# EAGLE design Schaltplan_neu (EAGLE 9.6.2)
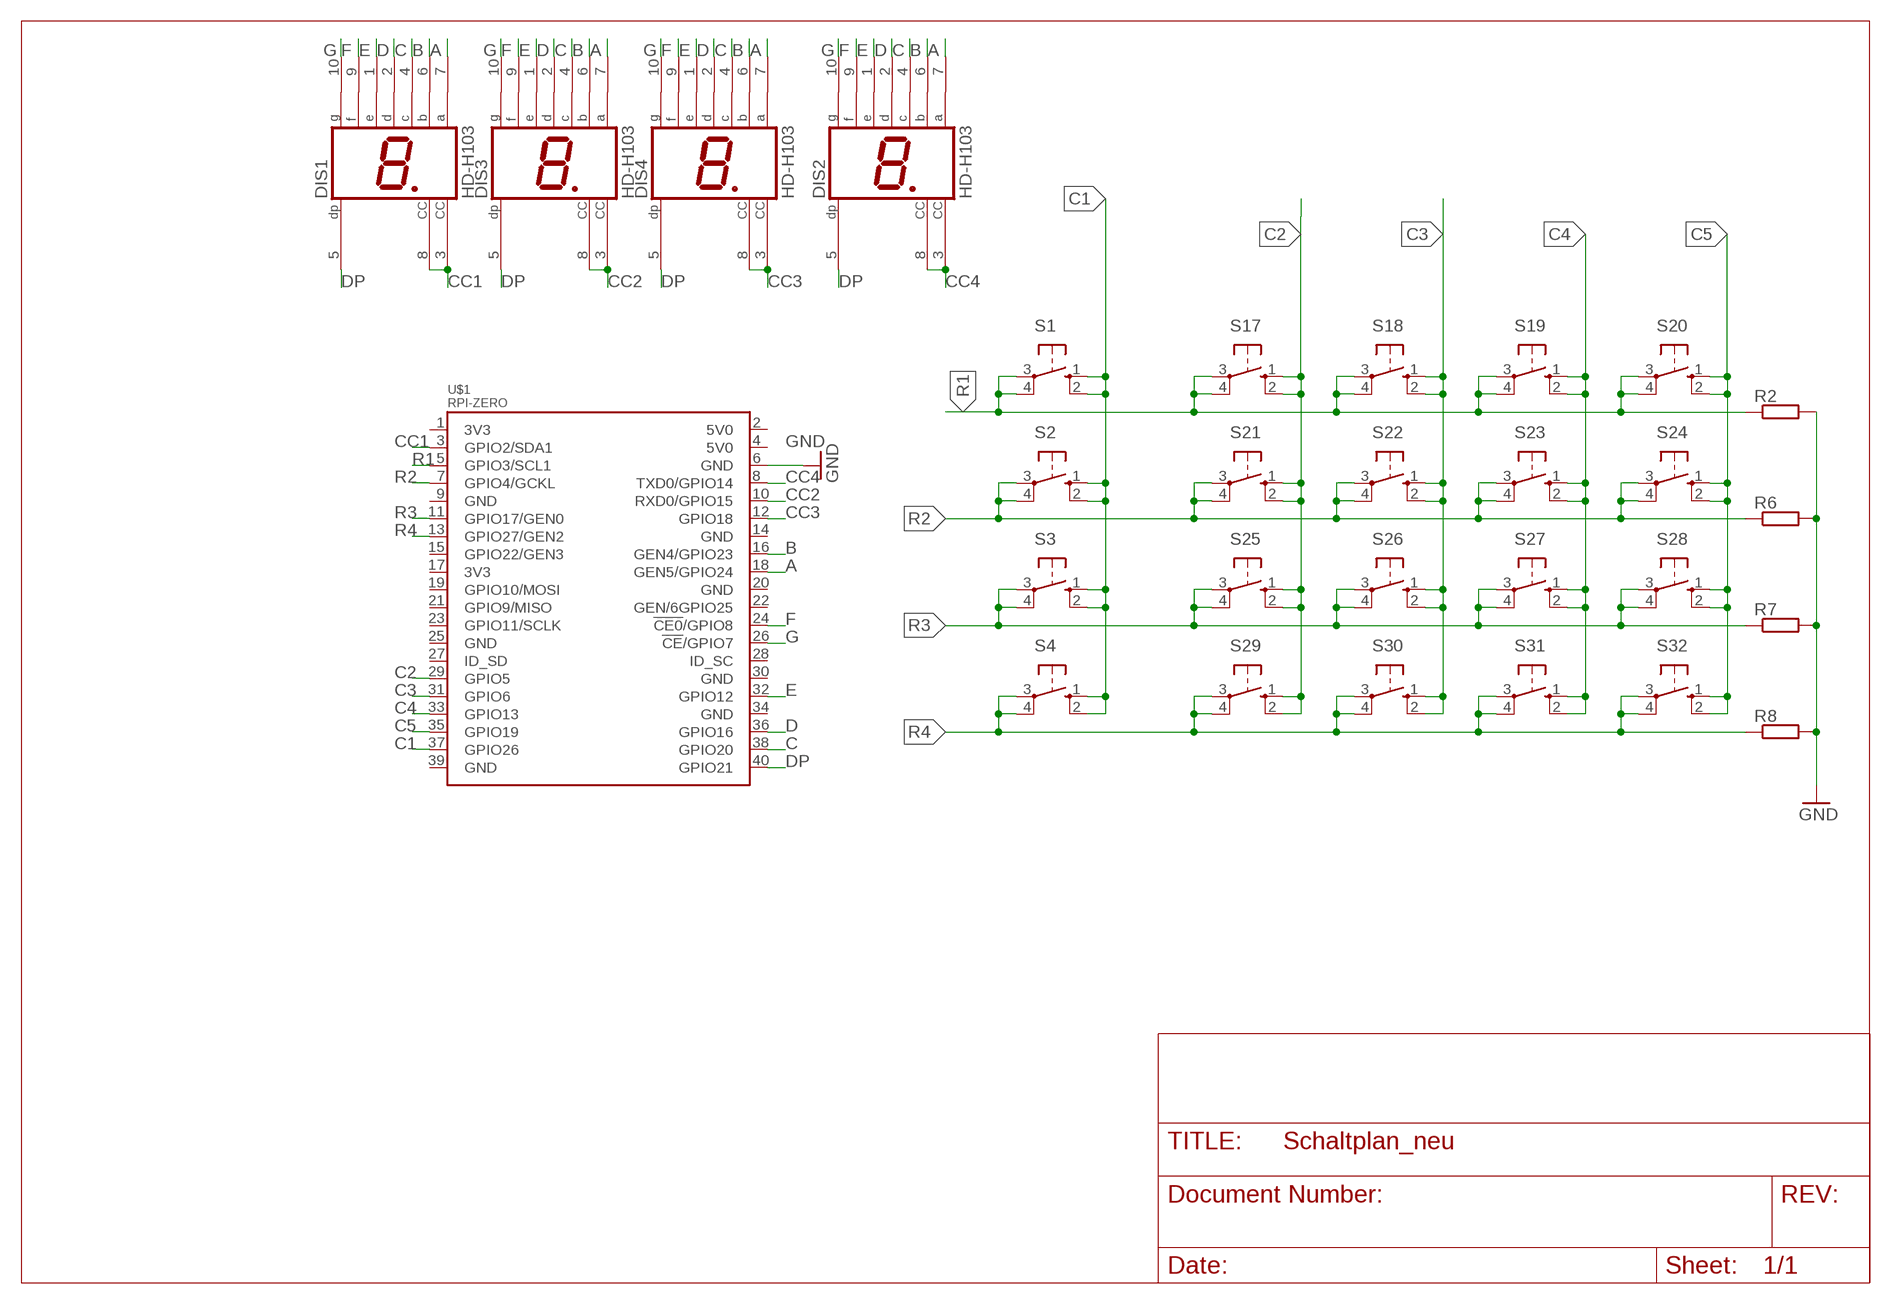
[diagram p0: schematic, sheet 1]

## Parts
DIS1  HD-H103  [HDSP-M]
DIS2  HD-H103  [HDSP-M]
DIS3  HD-H103  [HDSP-M]
DIS4  HD-H103  [HDSP-M]
R2  R-EU_0207/10  [0207/10]
R6  R-EU_0207/10  [0207/10]
R7  R-EU_0207/10  [0207/10]
R8  R-EU_0207/10  [0207/10]
S1  10-XX  [B3F-10XX]
S2  10-XX  [B3F-10XX]
S3  10-XX  [B3F-10XX]
S4  10-XX  [B3F-10XX]
S17  10-XX  [B3F-10XX]
S18  10-XX  [B3F-10XX]
S19  10-XX  [B3F-10XX]
S20  10-XX  [B3F-10XX]
S21  10-XX  [B3F-10XX]
S22  10-XX  [B3F-10XX]
S23  10-XX  [B3F-10XX]
S24  10-XX  [B3F-10XX]
S25  10-XX  [B3F-10XX]
S26  10-XX  [B3F-10XX]
S27  10-XX  [B3F-10XX]
S28  10-XX  [B3F-10XX]
S29  10-XX  [B3F-10XX]
S30  10-XX  [B3F-10XX]
S31  10-XX  [B3F-10XX]
S32  10-XX  [B3F-10XX]
U$1  RPI-ZERO  [RASP_PI_ZERO_BOARD_FULL]

## Nets
A: DIS1.7(A) DIS2.7(A) DIS3.7(A) DIS4.7(A) U$1.18(GEN5/GPIO24)
B: DIS1.6(B) DIS2.6(B) DIS3.6(B) DIS4.6(B) U$1.16(GEN4/GPIO23)
C: DIS1.4(C) DIS2.4(C) DIS3.4(C) DIS4.4(C) U$1.38(GPIO20)
C1: S1.1(S) S1.2(S1) S2.1(S) S2.2(S1) S3.1(S) S3.2(S1) S4.1(S) S4.2(S1) U$1.37(GPIO26)
C2: S17.1(S) S17.2(S1) S21.1(S) S21.2(S1) S25.1(S) S25.2(S1) S29.1(S) S29.2(S1) U$1.29(GPIO5)
C3: S18.1(S) S18.2(S1) S22.1(S) S22.2(S1) S26.1(S) S26.2(S1) S30.1(S) S30.2(S1) U$1.31(GPIO6)
C4: S19.1(S) S19.2(S1) S23.1(S) S23.2(S1) S27.1(S) S27.2(S1) S31.1(S) S31.2(S1) U$1.33(GPIO13)
C5: S20.1(S) S20.2(S1) S24.1(S) S24.2(S1) S28.1(S) S28.2(S1) S32.1(S) S32.2(S1) U$1.35(GPIO19)
CC1: DIS1.3(CC) DIS1.8(CC) U$1.3(GPIO2/SDA1)
CC2: DIS3.3(CC) DIS3.8(CC) U$1.10(RXD0/GPIO15)
CC3: DIS4.3(CC) DIS4.8(CC) U$1.12(GPIO18)
CC4: DIS2.3(CC) DIS2.8(CC) U$1.8(TXD0/GPIO14)
D: DIS1.2(D) DIS2.2(D) DIS3.2(D) DIS4.2(D) U$1.36(GPIO16)
DP: DIS1.5(DP) DIS2.5(DP) DIS3.5(DP) DIS4.5(DP) U$1.40(GPIO21)
E: DIS1.1(E) DIS2.1(E) DIS3.1(E) DIS4.1(E) U$1.32(GPIO12)
F: DIS1.9(F) DIS2.9(F) DIS3.9(F) DIS4.9(F) U$1.24(!CE0!/GPIO8)
G: DIS1.10(G) DIS2.10(G) DIS3.10(G) DIS4.10(G) U$1.26(!CE!/GPIO7)
GND: R2.2 R6.2 R7.2 R8.2 U$1.6(GND)
R1: R2.1 S1.3(P) S1.4(P1) S17.3(P) S17.4(P1) S18.3(P) S18.4(P1) S19.3(P) S19.4(P1) S20.3(P) S20.4(P1) U$1.5(GPIO3/SCL1)
R2: R6.1 S2.3(P) S2.4(P1) S21.3(P) S21.4(P1) S22.3(P) S22.4(P1) S23.3(P) S23.4(P1) S24.3(P) S24.4(P1) U$1.7(GPIO4/GCKL)
R3: R7.1 S3.3(P) S3.4(P1) S25.3(P) S25.4(P1) S26.3(P) S26.4(P1) S27.3(P) S27.4(P1) S28.3(P) S28.4(P1) U$1.11(GPIO17/GEN0)
R4: R8.1 S4.3(P) S4.4(P1) S29.3(P) S29.4(P1) S30.3(P) S30.4(P1) S31.3(P) S31.4(P1) S32.3(P) S32.4(P1) U$1.13(GPIO27/GEN2)
Unconnected: U$1.1(3V3) U$1.2(5V0) U$1.4(5V0) U$1.9(GND) U$1.14(GND) U$1.15(GPIO22/GEN3) U$1.17(3V3) U$1.19(GPIO10/MOSI) U$1.20(GND) U$1.21(GPIO9/MISO) U$1.22(GEN/6GPIO25) U$1.23(GPIO11/SCLK) U$1.25(GND) U$1.27(ID_SD) U$1.28(ID_SC) U$1.30(GND) U$1.34(GND) U$1.39(GND)

## Library data of the parts
DIS1-DIS4 = display-hp:HD-H103: LED DISPLAY 1-character 7 segment, decimal point right; OC_FARNELL: unknown; OC_NEWARK: unknown
R2 R6-R8 = rcl:R-EU_: RESISTOR, European symbol; SPICEPREFIX: R
S1-S4 S17-S32 = switch-omron:10-XX: OMRON SWITCH; MPN: B3F-1000; OC_FARNELL: 176432; OC_NEWARK: 36M3542
U$1 = rpi-zero_2:RPI-ZERO

## Board
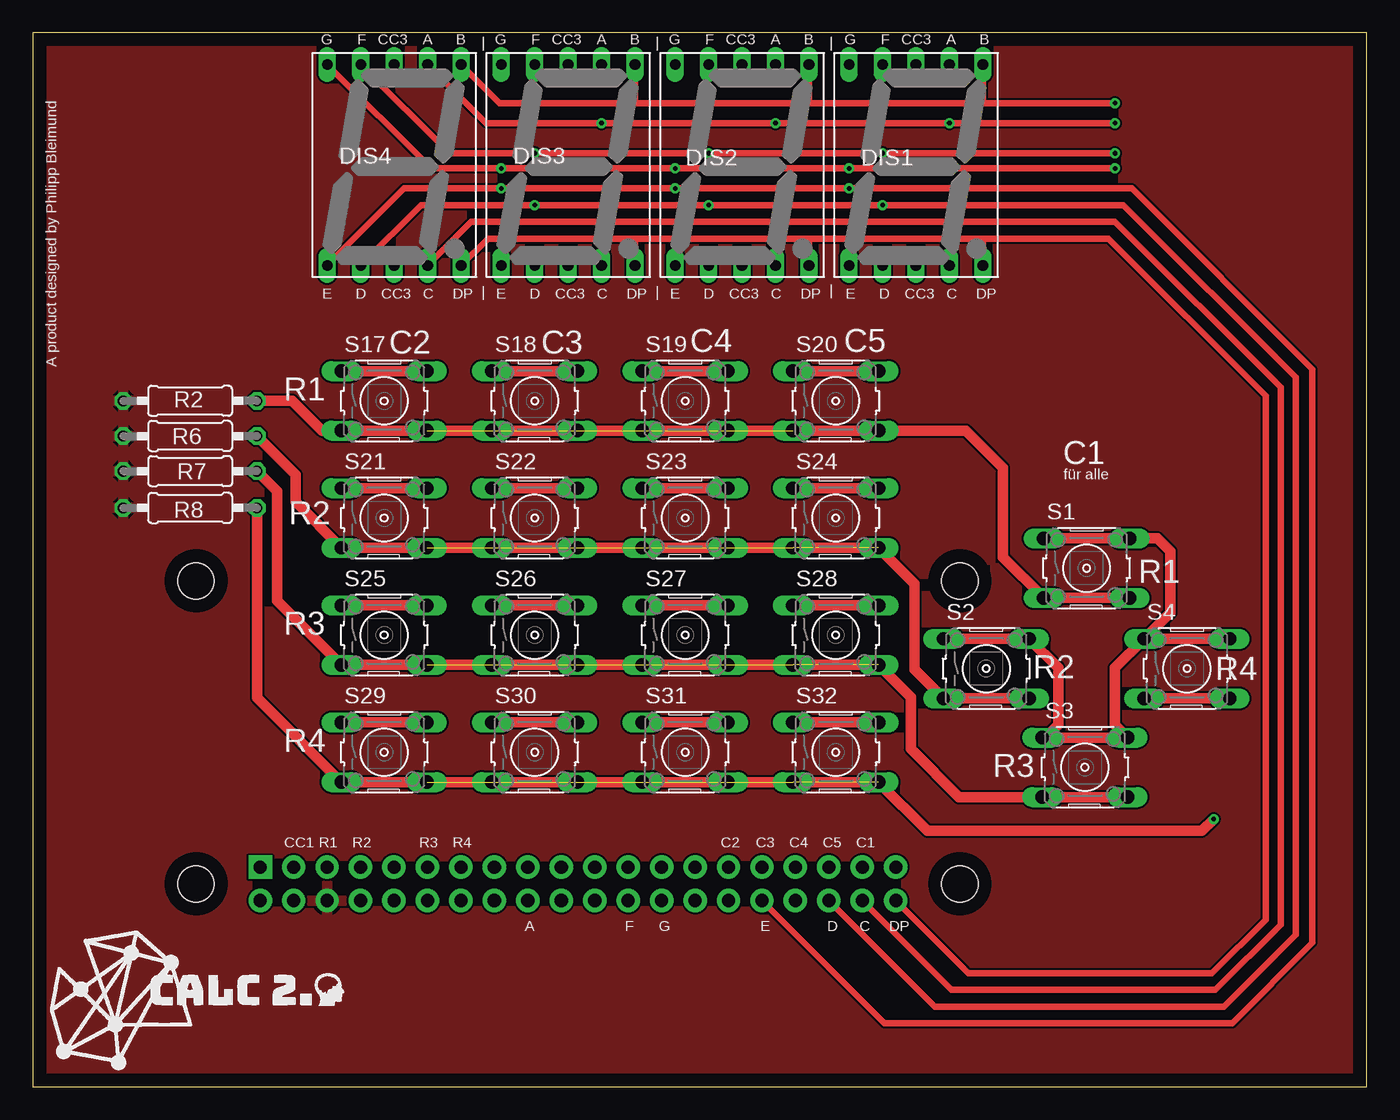
[diagram p1: board, top side]
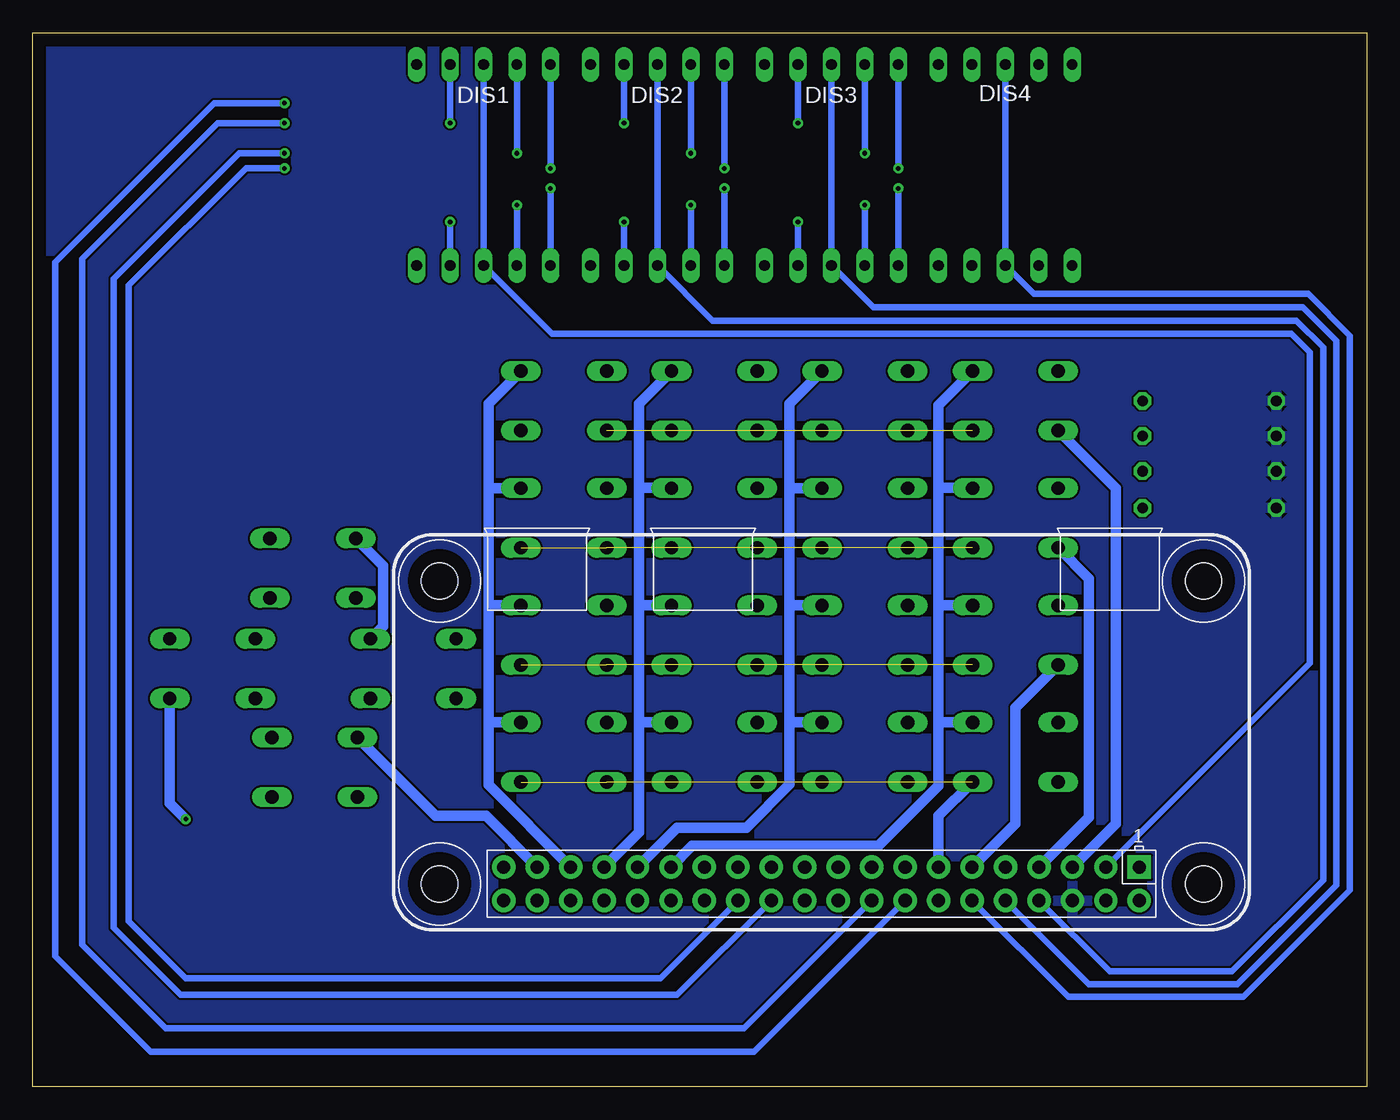
[diagram p2: board, bottom side, seen from below]

Size 101.27 x 80 mm. Coordinates in mm from the lower left corner, seen from the top.
Outline: 0,0 101.27,0 101.27,80 0,80 0,0
Copper layers (1*16): Top 0.035mm / dielectric 1.5mm / Bottom 0.035mm
Design rules "default": minimum track width 6mil, minimum drill 0.35mm, track to track 6mil, track to pad 6mil, pad to pad 6mil, via to via 6mil, smd to smd 6mil, copper to edge 40mil, drill to drill 6mil, minimum pad ring 10mil, minimum via ring 8mil, stop-mask expansion 4mil, vias tented up to drill 0mil, thermal gap 10mil

### Footprints (pad centres in the part's own frame; a part is rotated, then mirrored left to right if it is on the bottom)
HDSP-M = drill 0.813 long: 1 -5.08,-7.62; 2 -2.54,-7.62; 3 0,-7.62; 4 2.54,-7.62; 5 5.08,-7.62; 6 5.08,7.62; 7 2.54,7.62; 8 0,7.62; 9 -2.54,7.62; 10 -5.08,7.62
0207/10 = drill 0.813 octagon: 1 -5.08,0; 2 5.08,0
B3F-10XX = drill 1.016 long: 1 -3.251,2.261; 2 3.251,2.261; 3 -3.251,-2.261; 4 3.251,-2.261
RASP_PI_ZERO_BOARD_FULL = drill 1 pad 1.778 square: 1 8.37,25.23 | drill 1 pad 1.778: 2 8.37,27.77; 3 10.91,25.23; 4 10.91,27.77; 5 13.45,25.23; 6 13.45,27.77; 7 15.99,25.23; 8 15.99,27.77; 9 18.53,25.23; 10 18.53,27.77; 11 21.07,25.23; 12 21.07,27.77; 13 23.61,25.23; 14 23.61,27.77; 15 26.15,25.23; 16 26.15,27.77; 17 28.69,25.23; 18 28.69,27.77; 19 31.23,25.23; 20 31.23,27.77; 21 33.77,25.23; 22 33.77,27.77; 23 36.31,25.23; 24 36.31,27.77; 25 38.85,25.23; 26 38.85,27.77; 27 41.39,25.23; 28 41.39,27.77; 29 43.93,25.23; 30 43.93,27.77; 31 46.47,25.23; 32 46.47,27.77; 33 49.01,25.23; 34 49.01,27.77; 35 51.55,25.23; 36 51.55,27.77; 37 54.09,25.23; 38 54.09,27.77; 39 56.63,25.23; 40 56.63,27.77 | hole 2.75: 3.5,3.5; 3.5,26.5; 61.5,3.5; 61.5,26.5

### Placement (x,y rotation side)
DIS1  67.06,69.98 0 top
DIS2  53.85,69.98 0 top
DIS3  40.64,69.98 0 top
DIS4  27.43,69.98 0 top
R2  11.94,52.07 180 top
R6  11.94,49.4 180 top
R7  11.94,46.74 180 top
R8  11.94,43.94 180 top
S1  80.01,39.37 0 top
S2  72.39,31.75 0 top
S3  79.88,24.26 0 top
S4  87.63,31.75 0 top
S17  26.67,52.07 0 top
S18  38.1,52.07 0 top
S19  49.53,52.07 0 top
S20  60.96,52.07 0 top
S21  26.67,43.18 0 top
S22  38.1,43.18 0 top
S23  49.53,43.18 0 top
S24  60.96,43.18 0 top
S25  26.67,34.29 0 top
S26  38.1,34.29 0 top
S27  49.53,34.29 0 top
S28  60.96,34.29 0 top
S29  26.67,25.4 0 top
S30  38.1,25.4 0 top
S31  49.53,25.4 0 top
S32  60.96,25.4 0 top
U$1  8.89,41.91 180 bottom

### Tracks (layer width: path | path; a pad name or v marks a point on that pad's centre or on a via)
A  (via drill 0.35)
  Top 0.508: v82.17,73.15 v69.6,73.15 v56.39,73.15 v43.18,73.15 34.42,73.15 DIS4.7
  Bottom 0.508: U$1.18 47.28,4.45 91.19,4.45 97.54,10.79 97.54,62.87 87.25,73.15 v82.17,73.15 | DIS3.7 v43.18,73.15 | DIS2.7 v56.39,73.15 | DIS1.7 v69.6,73.15
B  (via drill 0.35)
  Top 0.508: DIS4.6 35.43,74.68 45.72,74.68 | v82.17,74.68 72.14,74.68 | 72.14,74.68 58.93,74.68 | 58.93,74.68 45.72,74.68 | DIS3.6 45.72,74.68 | DIS2.6 58.93,74.68 | DIS1.6 72.14,74.68
  Bottom 0.508: U$1.16 46.51,2.67 92.33,2.67 99.57,9.91 99.57,62.61 87.5,74.68 v82.17,74.68
C  (via drill 0.35)
  Top 0.508: U$1.38 69.75,7.37 89.79,7.37 94.74,12.32 94.74,53.09 82.17,65.66 v69.6,65.66 v56.39,65.66 v43.18,65.66 33.27,65.66 DIS4.4
  Bottom 0.508: DIS3.4 v43.18,65.66 | DIS2.4 v56.39,65.66 | DIS1.4 v69.6,65.66
C1
  Top 0.813: S4.1 S4.2 | S1.1 S1.2 85.37,41.63 86.36,40.64 86.36,35.99 S4.1 | 76.89,26.52 S3.2 82.17,27.48 82.17,31.8 S4.1 | 76.89,26.52 S3.1 | 76.89,26.52 77.85,27.48 77.85,31.8 S2.2 S2.1
  Bottom 0.813: S2.2 74.68,34.98 74.68,39.55 S1.1 | S3.1 70.69,20.57 66.87,20.57 U$1.37
C2
  Top 0.813: S17.1 S17.2 | S21.1 S21.2 | S25.1 S25.2 | S29.1 S29.2
  Bottom 0.813: S17.2 32.51,51.74 32.51,45.47 | 32.51,45.47 32.51,36.58 | S21.2 29.95,45.47 32.51,45.47 | S25.2 32.49,36.55 32.51,36.58 | 32.51,36.58 32.51,27.56 | 32.51,27.56 32.51,22.85 37.07,18.29 51.21,18.29 U$1.29 | S29.2 32.41,27.66 32.51,27.56
C3
  Top 0.813: S18.1 S18.2 | S22.1 S22.2 | S26.1 S26.2 | S30.1 S30.2
  Bottom 0.813: S18.2 43.82,51.87 43.82,45.59 | 43.82,36.58 43.82,45.59 | S22.2 43.66,45.44 43.82,45.59 | S26.2 43.79,36.55 43.82,36.58 | 43.82,36.58 43.82,27.69 | 43.82,27.69 43.82,22.97 47.1,19.68 52.36,19.68 U$1.31 | S30.2 43.79,27.66 43.82,27.69
C4
  Top 0.813: S31.1 S31.2 | S27.1 S27.2 | S23.1 S23.2 | S19.1 S19.2
  Bottom 0.813: S19.2 55.25,51.87 55.25,45.47 | 55.25,45.47 55.25,36.58 55.22,36.55 | S23.2 52.81,45.47 55.25,45.47 | S27.2 55.22,36.55 | 55.22,36.55 55.25,36.52 55.25,27.56 | U$1.33 55.25,19.34 55.25,27.56 | S31.2 55.14,27.66 55.25,27.56
C5
  Top 0.813: S20.1 S20.2 | S24.1 S24.2 | S28.1 S28.2 | S32.1 S32.2
  Bottom 0.813: S20.2 66.67,51.87 66.67,45.47 | 66.67,36.58 66.67,45.47 | S24.2 66.65,45.44 66.67,45.47 | S28.2 66.65,36.55 66.67,36.58 | U$1.35 66.67,22.91 66.67,27.69 | 66.67,36.58 66.67,27.69 | S32.2 66.65,27.66 66.67,27.69
CC1
  Bottom 0.508: DIS1.8 DIS1.3 61.85,57.15 5.71,57.15 4.32,55.75 4.32,32.16 U$1.3
CC2
  Bottom 0.508: DIS3.8 DIS3.3 37.47,59.18 4.83,59.18 2.29,56.64 2.29,15.32 9.8,7.8 21.08,7.8 U$1.10
CC3
  Bottom 0.508: DIS4.8 DIS4.3 25.27,60.2 4.45,60.2 1.27,57.02 1.27,14.91 9.35,6.83 22.65,6.83 U$1.12
CC4
  Bottom 0.508: DIS2.8 DIS2.3 49.66,58.17 5.33,58.17 3.3,56.13 3.3,15.7 10.24,8.76 19.5,8.76 U$1.8
D  (via drill 0.35)
  Top 0.508: U$1.36 68.48,6.1 90.42,6.1 95.88,11.56 95.88,53.85 82.8,66.93 v64.52,66.93 v51.31,66.93 v38.1,66.93 29.46,66.93 DIS4.2
  Bottom 0.508: DIS3.2 v38.1,66.93 | DIS2.2 v51.31,66.93 | DIS1.2 v64.52,66.93
DP
  Top 0.508: U$1.40 71.02,8.64 89.53,8.64 93.6,12.7 93.6,52.45 81.66,64.39 72.14,64.39 | 72.14,64.39 58.93,64.39 | 58.93,64.39 45.72,64.39 | 45.72,64.39 34.54,64.39 DIS4.5 | DIS1.5 72.14,64.39 | DIS2.5 58.93,64.39 | DIS3.5 45.72,64.39
E  (via drill 0.35)
  Top 0.508: U$1.32 64.67,4.83 91.06,4.83 97.16,10.92 97.16,54.48 83.44,68.2 v61.98,68.2 v48.77,68.2 v35.56,68.2 28.19,68.2 DIS4.1
  Bottom 0.508: DIS3.1 v35.56,68.2 | DIS2.1 v48.77,68.2 | DIS1.1 v61.98,68.2
F  (via drill 0.35)
  Top 0.508: v82.17,70.87 v64.52,70.87 v51.31,70.87 v38.1,70.87 31.62,70.87 DIS4.9
  Bottom 0.508: U$1.24 52.36,6.99 90.04,6.99 95.12,12.06 95.12,61.34 85.6,70.87 v82.17,70.87 | DIS3.9 v38.1,70.87 | DIS2.9 v51.31,70.87 | DIS1.9 v64.52,70.87
G  (via drill 0.35)
  Top 0.508: v82.17,69.72 v61.98,69.72 v48.77,69.72 v35.56,69.72 30.23,69.72 DIS4.10
  Bottom 0.508: U$1.26 53.62,8.26 89.66,8.26 93.98,12.57 93.98,60.83 85.07,69.75 82.19,69.75 v82.17,69.72 | DIS3.10 v35.56,69.72 | DIS2.10 v48.77,69.72 | DIS1.10 v61.98,69.72
GND
  pour Top: 0,0 101.22,0 101.22,72.52 101.22,79.76 0,79.76
  pour Bottom: -0.25,0.47 101.22,0.47 101.22,80.14 -0.25,80.14
R1  (5 unrouted)
  Top 0.813: 76.76,37.26 S1.3 | S1.3 S1.4 | R2.1 19.68,52.07 21.95,49.81 S17.3 S17.4 S20.4 70.84,49.81 73.66,46.99 73.66,40.21 S1.3
  Bottom 0.813: S17.3 19.05,45.44 19.05,19.97 U$1.5
R2  (6 unrouted)
  Top 0.813: S2.4 S2.3 66.93,31.7 66.93,38.2 S24.4 S21.3 19.94,44.4 19.94,46.48 R6.1
  Bottom 0.813: S21.3 21.08,38.58 21.08,20.48 U$1.7
R3  (6 unrouted)
  Top 0.813: S3.4 S3.3 70.33,22 66.67,25.65 66.67,29.57 S28.4 S25.3 18.54,36.91 18.54,45.21 R7.1
  Bottom 0.813: S25.3 26.67,28.78 26.67,19.97 U$1.11
R4  (via drill 0.35)  (6 unrouted)
  Top 0.813: S4.3 S4.4 | R8.1 17.02,29.54 S29.3 S32.4 67.92,19.43 88.77,19.43 v89.66,20.32
  Bottom 0.813: v89.66,20.32 90.88,21.54 S4.4 | S29.4 32.5,20.56 U$1.13

### Text on the board
tNames: G | F | CC3 | A | B | | | G | F | CC3 | A | B | | | G | F | CC3 | A | B | | | G | F | CC3 | A | B | E | D | CC3 | C | DP | | | E | D | CC3 | C | DP | | | E | D | CC3 | C | DP | | | E | D | CC3 | C | DP | C2 | C3 | C4 | C5 | A product designed by Philipp Bleimund | R1 | C1 | für alle | R2 | R1 | R3 | R2 | R4 | R4 | R3 | CC1 | R1 | R2 | R3 | R4 | C2 | C3 | C4 | C5 | C1 | A | F | G | E | D | C | DP
bNames: DIS4 | DIS3 | DIS2 | DIS1